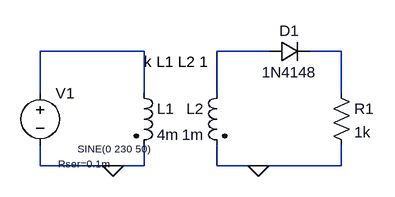
[diagram p0: schematic halfwave_rectifier eclab4.asc]
halfwave_rectifier eclab4.asc, the LTspice schematic file:
Version 4
SHEET 1 880 680
WIRE 208 48 48 48
WIRE 400 48 320 48
WIRE 512 48 464 48
WIRE 48 112 48 48
WIRE 208 112 208 48
WIRE 320 112 320 48
WIRE 512 112 512 48
WIRE 48 224 48 192
WIRE 160 224 48 224
WIRE 208 224 208 192
WIRE 208 224 160 224
WIRE 320 224 320 192
WIRE 384 224 320 224
WIRE 512 224 512 192
WIRE 512 224 384 224
FLAG 384 224 0
FLAG 160 224 0
SYMBOL ind2 192 96 R0
SYMATTR InstName L1
SYMATTR Value 4m
SYMATTR Type ind
SYMBOL ind2 336 96 M0
SYMATTR InstName L2
SYMATTR Value 1m
SYMATTR Type ind
SYMBOL diode 400 64 R270
WINDOW 0 32 32 VTop 2
WINDOW 3 0 32 VBottom 2
SYMATTR InstName D1
SYMATTR Value 1N4148
SYMBOL res 496 96 R0
SYMATTR InstName R1
SYMATTR Value 1k
SYMBOL voltage 48 96 R0
WINDOW 3 113 91 Top 1
WINDOW 123 0 0 Left 0
WINDOW 39 67 114 Top 1
SYMATTR InstName V1
SYMATTR Value SINE(0 230 50)
SYMATTR SpiceLine Rser=0.1m
TEXT 208 64 Left 2 !k L1 L2 1

The netlist it stands for:
* halfwave_rectifier eclab4.asc
L1 N001 0 4m
L2 N002 0 1m
D1 N002 N003 1N4148
R1 N003 0 1k
V1 N001 0 SINE(0 230 50) Rser=0.1m
.model D D
.lib standard.dio
k L1 L2 1
.backanno
.end